# Altium project BSPD.PrjPcb
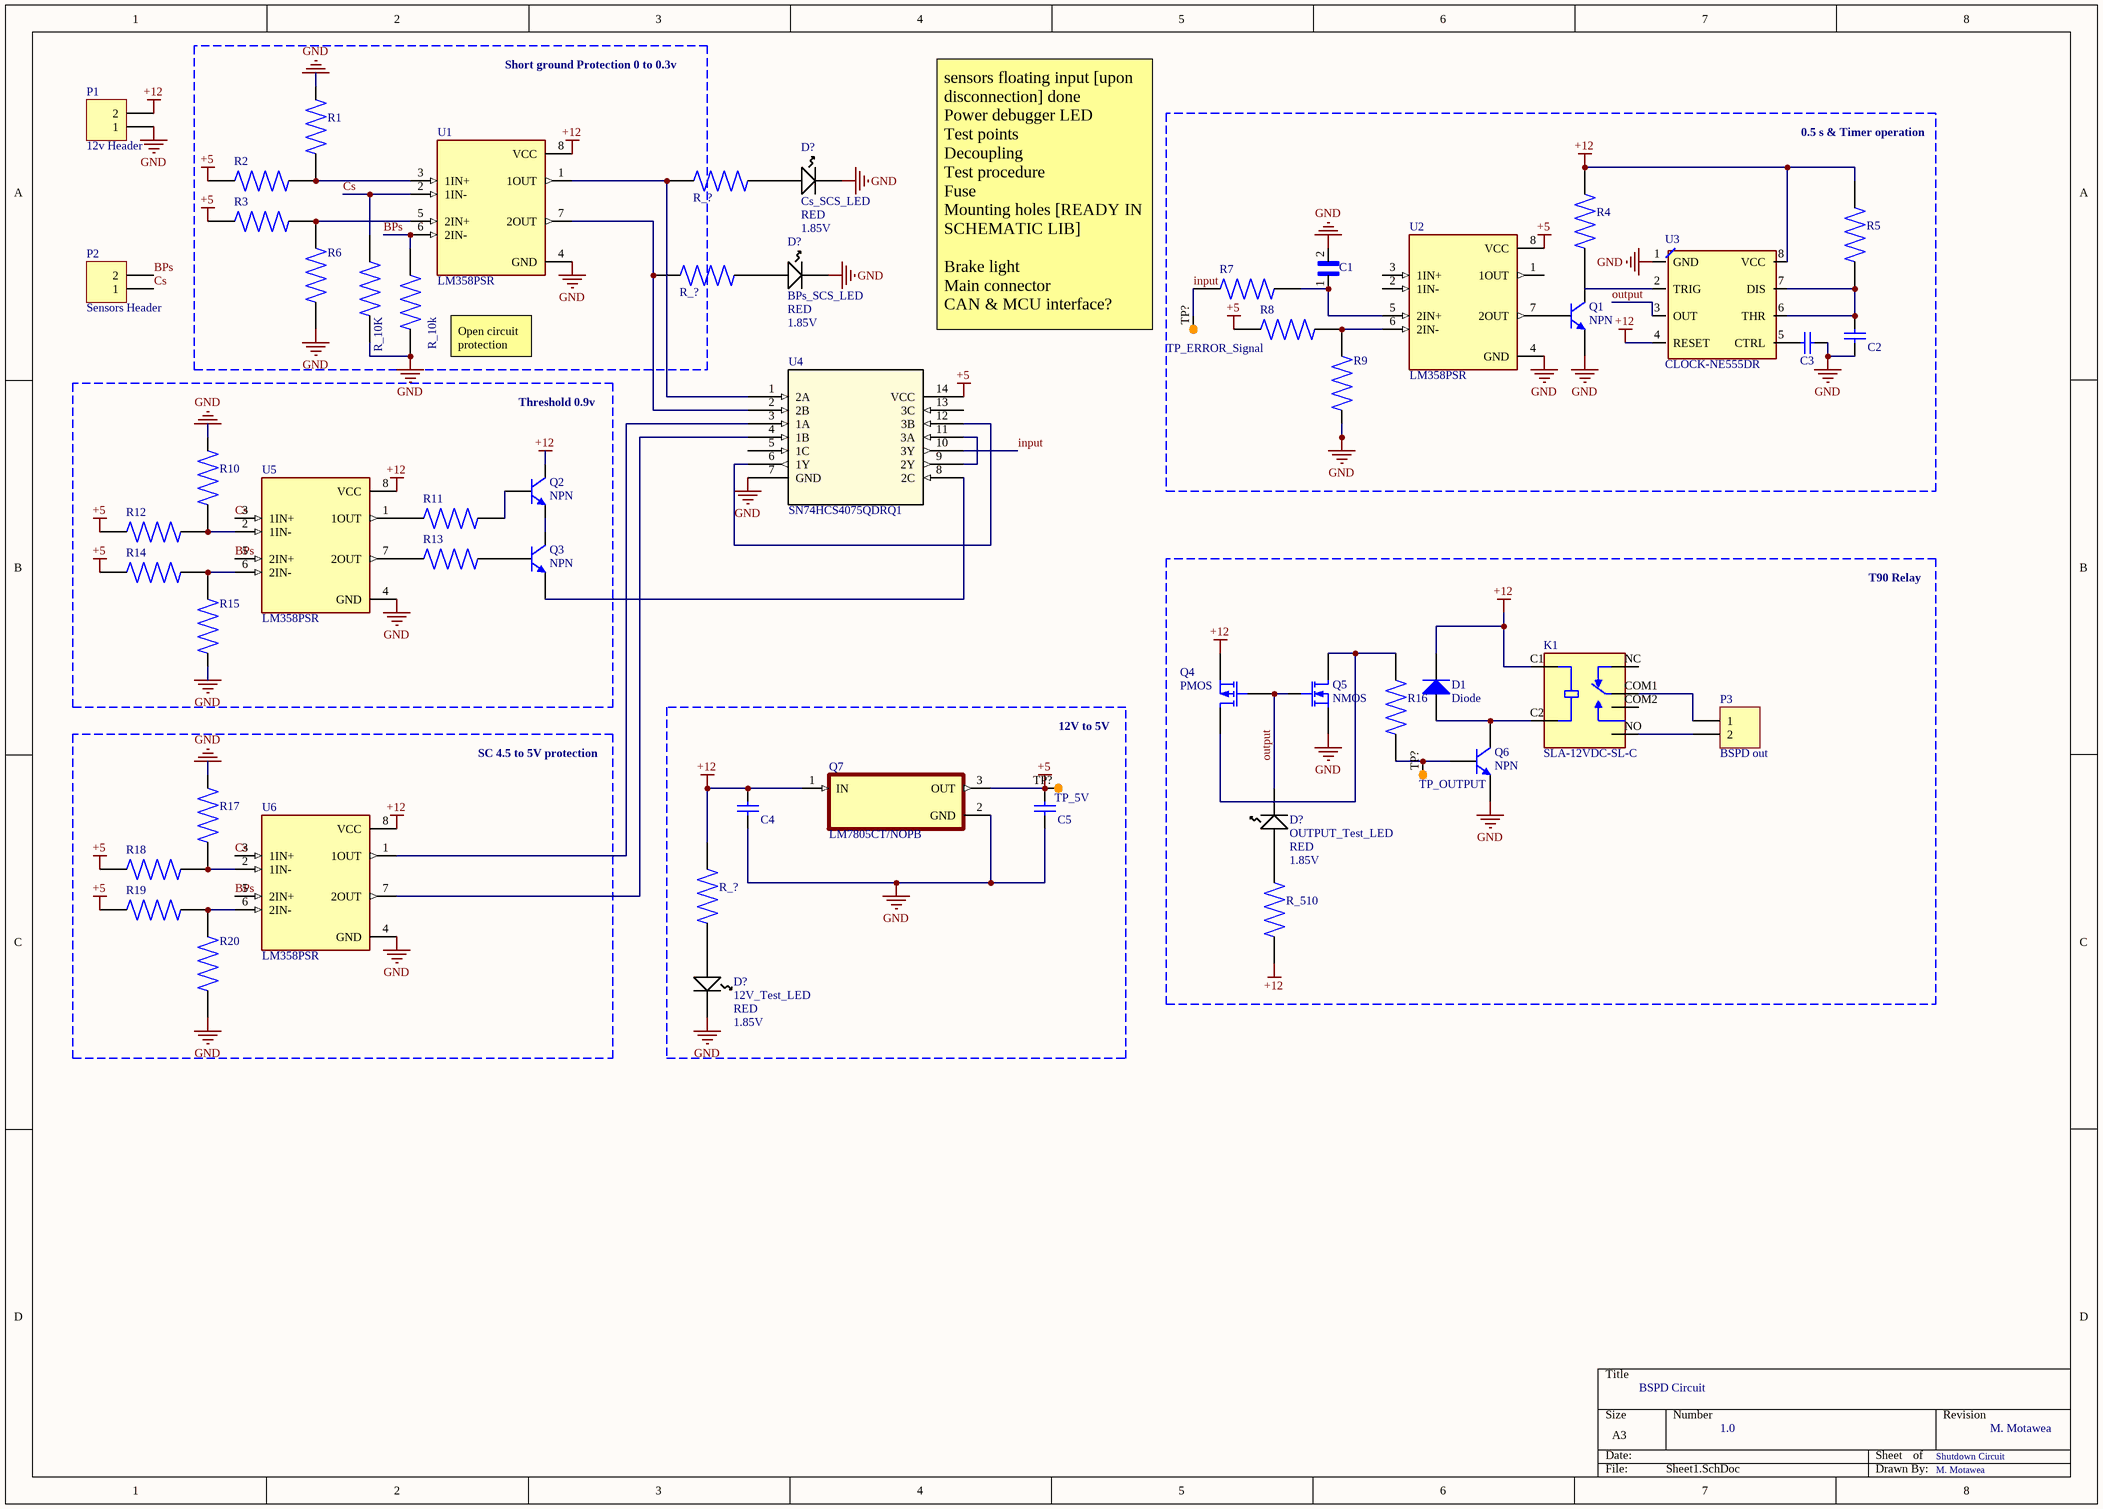
[diagram p0: Sheet1.SchDoc]
Author: M. Motawea; Project: BSPD Circuit
1 sheet, 56 parts. Net scope: global (net labels, ports and power ports of the same name join across sheets).
Board file: PCB1.PcbDoc

## Sheet Sheet1.SchDoc
size A3; SheetNumber: 1; SheetTotal: 1; SPICEModelCacheMZGQAUMV: <root> / <DocumentId>MZGQAUMV</DocumentId> / <CacheFrame Number="0"> / <Model Name="npn" Kind="MDL"> / <Text>*Default NPN BJT / *NPN Trans Pinout: C,B,E / .MODEL NPN NPN()</Text> / </Model> / <Model Name="1812_885012210019_10nf" Kind="CKT"> / <Text>******* / .subckt 1812_885012210019_10nF 1 2 / Rser 1 3 0.07293 / Lser 2 4 0.00000000052871 / C1 3 4 0.00000001 / Rpar 3 4 10000000000 / .ends 1812_885012210019_10nF</Text> / </Model> / <Model Name="2220_885012214006_10uf" Kind="CKT"> / <Text>******* / .subckt 2220_885012214006_10uF 1 2 / Rser 1 3 0.003 / Lser 2 4 0.0000000012 / C1 3 4 0.00001 / Rpar 3 4 10000000 / .ends 2220_885012214006_10uF</Text> / </Model> / <Model Name="diode" Kind="MDL"> / <Text>*Default Diode / *Diode Pinout: A,K / .MODEL DIODE D()</Text> / </Model> / <Model Name="nmos" Kind="MDL"> / <Text>*Default N-Channel MOSFET / *Pinout: D,G,S / .MODEL NMOS NMOS()</Text> / </Model> / <Model Name="pmos" Kind="MDL"> / <Text>*Default P-Channel MOSFET / *Pinout: D,G,S / .MODEL PMOS PMOS()</Text> / </Model> / <Model Name="1210_885012209020_220nf" Kind="CKT"> / <Text>******* / .subckt 1210_885012209020_220nF 1 2 / Rser 1 3 0.0109918196754 / Lser 2 4 5.14177759E-10 / C1 3 4 0.00000022 / Rpar 3 4 2300000000 / .ends 1210_885012209020_220nF</Text> / </Model> / <Model Name="1210_885012209019_100nf" Kind="CKT"> / <Text>******* / .subckt 1210_885012209019_100nF 1 2 / Rser 1 3 0.0209574310072 / Lser 2 4 5.49171232E-10 / C1 3 4 0.0000001 / Rpar 3 4 5000000000 / .ends 1210_885012209019_100nF</Text> / </Model> / </CacheFrame> / </root>

### Parts
(Parts that share a designator on the sheet are numbered #1, #2 ... from top to bottom, then left to right.)
C1  GRM21BR60J107ME15K  [CAPC2012X145N]  (value not drawn)
C2  10uF  [WCAP-CSGP_2220_L5.7W5H2.8]  (value not drawn)
C3  10nF  [WCAP-CSGP_1812_L4.5W3.2H1.25]  (value not drawn)
C4  220nF  [WCAP-CSGP_1210_L3.2W2.5H0.95]  (value not drawn)
C5  100nF  [WCAP-CSGP_1210_L3.2W2.5H0.95]  (value not drawn)
D1  Diode  [SMC]
D?#1  Cs_SCS_LED  Color: RED  Forward Voltage: 1.85V  [LED1913X12NRED]
D?#2  BPs_SCS_LED  Color: RED  Forward Voltage: 1.85V  [LED1913X12NRED]
D?#3  OUTPUT_Test_LED  Color: RED  Forward Voltage: 1.85V  [LED1913X12NRED]
D?#4  12V_Test_LED  Color: RED  Forward Voltage: 1.85V  [LED1913X12NRED]
K1  SLA-12VDC-SL-C  [RELAY_SLA-12VDC-SL-C]
P1  12v Header  [HDR1X2]
P2  Sensors Header  [HDR1X2]
P3  BSPD out  [HDR1X2]
Q1  NPN  [TO-226-AA]
Q2  NPN  [TO-226-AA]
Q3  NPN  [TO-226-AA]
Q4  PMOS  [E3]
Q5  NMOS  [E3]
Q6  NPN  [TO-226-AA]
Q7  LM7805CT/NOPB  [TO254P1054X470X1955-3]
R1  ERJU08J274V  [RES_ERJU08J274V]  (value not drawn)
R2  ERJU08J274V  [RES_ERJU08J274V]  (value not drawn)
R3  ERJU08J274V  [RES_ERJU08J274V]  (value not drawn)
R4  ERJU08J274V  [RES_ERJU08J274V]  (value not drawn)
R5  ERJU08J274V  [RES_ERJU08J274V]  (value not drawn)
R6  ERJU08J274V  [RES_ERJU08J274V]  (value not drawn)
R7  ERJU08J274V  [RES_ERJU08J274V]  (value not drawn)
R8  ERJU08J274V  [RES_ERJU08J274V]  (value not drawn)
R9  ERJU08J274V  [RES_ERJU08J274V]  (value not drawn)
R10  ERJU08J274V  [RES_ERJU08J274V]  (value not drawn)
R11  ERJU08J274V  [RES_ERJU08J274V]  (value not drawn)
R12  ERJU08J274V  [RES_ERJU08J274V]  (value not drawn)
R13  ERJU08J274V  [RES_ERJU08J274V]  (value not drawn)
R14  ERJU08J274V  [RES_ERJU08J274V]  (value not drawn)
R15  ERJU08J274V  [RES_ERJU08J274V]  (value not drawn)
R16  ERJU08J274V  [RES_ERJU08J274V]  (value not drawn)
R17  ERJU08J274V  [RES_ERJU08J274V]  (value not drawn)
R18  ERJU08J274V  [RES_ERJU08J274V]  (value not drawn)
R19  ERJU08J274V  [RES_ERJU08J274V]  (value not drawn)
R20  ERJU08J274V  [RES_ERJU08J274V]  (value not drawn)
R_10K#1  ERJU08J274V  [RES_ERJU08J274V]  (value not drawn)
R_10k#2  ERJU08J274V  [RES_ERJU08J274V]  (value not drawn)
R_510  ERJU08J274V  [RES_ERJU08J274V]  (value not drawn)
R_?#1  ERJU08J274V  [RES_ERJU08J274V]  (value not drawn)
R_?#2  ERJU08J274V  [RES_ERJU08J274V]  (value not drawn)
R_?#3  ERJU08J274V  [RES_ERJU08J274V]  (value not drawn)
TP_5V  TP  [Test point]  (value not drawn)
TP_ERROR_Signal  TP  [Test point]  (value not drawn)
TP_OUTPUT  TP  [Test point]  (value not drawn)
U1  LM358PSR  [SOIC127P780X200-8N]
U2  LM358PSR  [SOIC127P780X200-8N]
U3  CLOCK-NE555DR  [SOIC8-1.27-5X4MM]
U4  SN74HCS4075QDRQ1  [SOIC14_D_TEX]
U5  LM358PSR  [SOIC127P780X200-8N]
U6  LM358PSR  [SOIC127P780X200-8N]

### Blocks framed on the sheet
Short ground Protection 0 to 0.3v: R1-R3 R6 R_10K#1 R_10k#2 U1
0.5 s & Timer operation: C1-C3 Q1 R4 R5 R7-R9 TP_ERROR_Signal U2 U3
Threshold 0.9v: Q2 Q3 R10-R15 U5
T90 Relay: D1 D?#3 K1 P3 Q4-Q6 R16 R_510 TP_OUTPUT
12V to 5V: C4 C5 D?#4 Q7 R_?#3 TP_5V
SC 4.5 to 5V protection: R17-R20 U6

### Nets
+5: C5.2 Q7.3(OUT) R2.1 R3.1 R8.1 R12.1 R14.1 R18.1 R19.1 TP_5V.TP?(Test_point) U2.8(VCC) U4.14(VCC)
+12: C4.2 D1.2(K) K1.C1(COIL1) P1.2 Q2.1(C) Q4.3(S) Q7.1(IN) R4.2 R5.2 R_510.1 R_?#3.1 U1.8(VCC) U3.4(RESET) U3.8(VCC) U5.8(VCC) U6.8(VCC)
GND: C1.2 C2.1 C3.2 C4.1 C5.1 D?#1.2(K) D?#2.2(K) D?#4.2(K) P1.1 Q1.3(E) Q5.3(S) Q6.3(E) Q7.2(GND) R1.2 R6.2 R9.2 R10.2 R15.2 R17.2 R20.2 R_10K#1.2 R_10k#2.2 U1.4(GND) U2.4(GND) U3.1(GND) U4.7(GND) U5.4(GND) U6.4(GND)
BPs: P2.2 R_10k#2.1 U1.6(2IN-) U5.5(2IN+) U6.5(2IN+)
Cs: P2.1 R_10K#1.1 U1.2(1IN-) U5.3(1IN+) U6.3(1IN+)
input: R7.1 TP_ERROR_Signal.TP?(Test_point) U4.10(3Y)
output: D?#3.2(K) Q4.2(G) Q5.2(G) U3.3(OUT)
NetC1_1: C1.1 R7.2 U2.5(2IN+)
NetC2_2: C2.2 R5.1 U3.6(THR) U3.7(DIS)
NetC3_1: C3.1 U3.5(CTRL)
NetD1_1: D1.1(A) K1.C2(COIL2) Q6.1(C)
NetD?#1_1: D?#1.1(A) R_?#1.2
NetD?#2_1: D?#2.1(A) R_?#2.2
NetD?#3_1: D?#3.1(A) R_510.2
NetD?#4_1: D?#4.1(A) R_?#3.2
NetK1_COM1: K1.COM1(COM) P3.1
NetK1_NO: K1.NO P3.2
NetQ1_1: Q1.1(C) R4.1
NetQ1_2: Q1.2(B) U2.7(2OUT)
NetQ2_2: Q2.2(B) R11.2
NetQ2_3: Q2.3(E) Q3.1(C)
NetQ3_2: Q3.2(B) R13.2
NetQ3_3: Q3.3(E) U4.8(2C)
NetQ4_1: Q4.1(D) Q5.1(D) R16.2
NetQ6_2: Q6.2(B) R16.1 TP_OUTPUT.TP?(Test_point)
NetR1_1: R1.1 R2.2 U1.3(1IN+)
NetR3_2: R3.2 R6.1 U1.5(2IN+)
NetR8_2: R8.2 R9.1 U2.6(2IN-)
NetR10_1: R10.1 R12.2 U5.2(1IN-)
NetR11_1: R11.1 U5.1(1OUT)
NetR13_1: R13.1 U5.7(2OUT)
NetR14_2: R14.2 R15.1 U5.6(2IN-)
NetR17_1: R17.1 R18.2 U6.2(1IN-)
NetR19_2: R19.2 R20.1 U6.6(2IN-)
NetR_?#1_1: R_?#1.1 U1.1(1OUT) U4.1(2A)
NetR_?#2_1: R_?#2.1 U1.7(2OUT) U4.2(2B)
NetU4_3: U4.3(1A) U6.1(1OUT)
NetU4_4: U4.4(1B) U6.7(2OUT)
NetU4_6: U4.6(1Y) U4.12(3B)
NetU4_9: U4.9(2Y) U4.11(3A)

Not connected (* = marked no-connect by the designer): K1 COM2(COM) NC; U2 1(1OUT) 2(1IN-) 3(1IN+); U3 2(TRIG); U4 5(1C) 13(3C)

### Notes on the sheet
- Open circuit protection
- (near TP_ERROR_Signal) sensors floating input [upon disconnection] done
  Power debugger LED
  Test points
  Decoupling
  Test procedure
  Fuse
  Mounting holes [READY IN SCHEMATIC LIB]
  Brake light
  Main connector
  CAN & MCU interface?
- 1.0
- Shutdown Circuit

### Library data of the parts
C1 = GRM21BR60J107ME15K: 0805 100 uF 6.3 V Â±20% Tolerance X7S Multilayer Ceramic Chip Capacitor; MF: Murata Electronics; Availability: In Stock; Price: None; SnapEDA_Link: https://www.snapeda.com/parts/GRM21BR60J107ME15K/Murata%20Electronics%20North%20America/view-part/1845859/?ref=snap; Value: *; Check_prices: https://www.snapeda.com/parts/GRM21BR60J107ME15K/Murata%20Electronics%20North%20America/view-part/1845859/?ref=eda; MP: GRM21BR60J107ME15K; Package: 2012 Murata
C2 = 885012214006: WCAP-CSGP Multilayer Ceramic Chip Capacitor, General Purpose, size 2220, X7R Class II, 10uF, 100VDC; Manufacturer: Wurth Elektronik; Case/Size Code: 2220; Capacitance Tolerance: +/-10%; Dissipation Factor: 2.5%; Insulation Resistance: 0.01GOhm; Rated Voltage (DC): 100V; Technical Reference: X7R2220106K100DFCT10000; Manufacturer Part Number: 885012214006; Category: Multilayer Ceramic Chip Capacitors; Match Code: WCAP-CSGP; ComponentLink1Description: Website Link; ComponentLink1URL: https://www.we-online.com/redexpert/article/885012214006?ad; ComponentLink2Description: Datasheet Link; ComponentLink2URL: https://www.we-online.com/redexpert/spec/885012214006?ad; Mount: Surface Mount; Operating Temperature Max: 125°C; Operating Temperature Min: -55°C; Packaging: Tape and Reel; Length: 5.7mm; Width: 5mm; Height: 2.8mm; Capacitance: 10uF; Ceramic Type: X7R Class II
C3 = 885012210019: WCAP-CSGP Multilayer Ceramic Chip Capacitor, General Purpose, size 1812, X7R, 10nF, 50VDC; Manufacturer: Wurth Elektronik; Case/Size Code: 1812; Capacitance Tolerance: +/-10%; Dissipation Factor: 2.5%; Insulation Resistance: 10GOhm; Rated Voltage (DC): 50V; Technical Reference: X7R1812103K050DFCT10000; Manufacturer Part Number: 885012210019; Category: Multilayer Ceramic Chip Capacitors; Match Code: WCAP-CSGP; ComponentLink1Description: Website Link; ComponentLink1URL: https://www.we-online.com/redexpert/article/885012210019?ad; ComponentLink2Description: Datasheet Link; ComponentLink2URL: https://www.we-online.com/redexpert/spec/885012210019?ad; Mount: Surface Mount; Operating Temperature Max: 125°C; Operating Temperature Min: -55°C; Packaging: Tape and Reel; Length: 4.5mm; Width: 3.2mm; Height: 1.25mm; Capacitance: 10nF; Ceramic Type: X7R
C4 = 885012209020: WCAP-CSGP Multilayer Ceramic Chip Capacitor, General Purpose, size 1210, X7R, 220nF, 25VDC; Manufacturer: Wurth Elektronik; Case/Size Code: 1210; Capacitance Tolerance: +/-10%; Dissipation Factor: 3.5%; Insulation Resistance: 2.3GOhm; Rated Voltage (DC): 25V; Technical Reference: X7R1210224K025DFCT10000; Manufacturer Part Number: 885012209020; Category: Multilayer Ceramic Chip Capacitors; Match Code: WCAP-CSGP; ComponentLink1Description: Website Link; ComponentLink1URL: https://www.we-online.com/redexpert/article/885012209020?ad; ComponentLink2Description: Datasheet Link; ComponentLink2URL: https://www.we-online.com/redexpert/spec/885012209020?ad; Mount: Surface Mount; Operating Temperature Max: 125°C; Operating Temperature Min: -55°C; Packaging: Tape and Reel; Length: 3.2mm; Width: 2.5mm; Height: 0.95mm; Capacitance: 220nF; Ceramic Type: X7R
C5 = 885012209019: WCAP-CSGP Multilayer Ceramic Chip Capacitor, General Purpose, size 1210, X7R, 100nF, 25VDC; Manufacturer: Wurth Elektronik; Case/Size Code: 1210; Capacitance Tolerance: +/-10%; Dissipation Factor: 3.5%; Insulation Resistance: 5GOhm; Rated Voltage (DC): 25V; Technical Reference: X7R1210104K025DFCT10000; Manufacturer Part Number: 885012209019; Category: Multilayer Ceramic Chip Capacitors; Match Code: WCAP-CSGP; ComponentLink1Description: Website Link; ComponentLink1URL: https://www.we-online.com/redexpert/article/885012209019?ad; ComponentLink2Description: Datasheet Link; ComponentLink2URL: https://www.we-online.com/redexpert/spec/885012209019?ad; Mount: Surface Mount; Operating Temperature Max: 125°C; Operating Temperature Min: -55°C; Packaging: Tape and Reel; Length: 3.2mm; Width: 2.5mm; Height: 0.95mm; Capacitance: 100nF; Ceramic Type: X7R
D1 = Diode: Default Diode; Published: 8-Jun-2000; LatestRevisionDate: 17-Jul-2002; LatestRevisionNote: Re-released for DXP Platform.; PackageVersion: Sep-1996; PackageReference: SMC; Publisher: Altium Limited; PackageDescription: DO-214-AB/SMC; 2 C-Bend Leads; Body 7.9 x 5.9 mm, inc. leads (LxW); Code_JEDEC: DO-214-AB
D?#1-D?#4 = Kingbright Red LED, 100 mcd 120 ° 0805: Manufacturer Part No.: KP-2012SRC-PRV; Creator: Ritesh Kanjee; Date Created: 18 February 2015; Manufacturer: KingBright; RS Stock No.: 466-3813; Datasheet URL: http://za.rs-online.com/web/p/visible-leds/4663813/
K1 = SLA-12VDC-SL-C: SUBMINATURE HIGH POWER RELAY; MF: Songle Relay; Value: *; SnapEDA_Link: https://www.snapeda.com/parts/SLA-12VDC-SL-C/Songle+Relay/view-part/?ref=snap; MP: SLA-12VDC-SL-C; Check_prices: https://www.snapeda.com/parts/SLA-12VDC-SL-C/Songle+Relay/view-part/?ref=eda; Availability: Not in stock; Price: None; Package: None
P1-P3 = Header 2: Header, 2-Pin; LatestRevisionDate: 17-Jul-2002; LatestRevisionNote: Re-released for DXP Platform.; Publisher: Altium Limited
Q1-Q3 Q6 = NPN: NPN Bipolar Transistor; Published: 8-Jun-2000; LatestRevisionDate: 17-Jul-2002; LatestRevisionNote: Re-released for DXP Platform.; PackageReference: TO-226-AA; Publisher: Altium Limited; PackageDescription: TO, Flat Index; 3 In-Line, Axial Leads; Body Dia. 4.8mm; Leads 0.55 x 0.51 mm (max); Code_JEDEC: TO-226-AA
Q4 = MOSFET-P: P-Channel MOSFET; Published: 8-Jun-2000; LatestRevisionDate: 17-Jul-2002; LatestRevisionNote: Re-released for DXP Platform.; PackageVersion: 1995/1996; PackageReference: E3; Publisher: Altium Limited; PackageDescription: TO, Flat Index; 3 In-Line, Axial Leads; Body Dia. 4.6mm; Lead Dia. 0.5 mm (max)
Q5 = MOSFET-N: N-Channel MOSFET; Published: 8-Jun-2000; LatestRevisionDate: 17-Jul-2002; LatestRevisionNote: Re-released for DXP Platform.; PackageVersion: 1995/1996; PackageReference: E3; Publisher: Altium Limited; PackageDescription: TO, Flat Index; 3 In-Line, Axial Leads; Body Dia. 4.6mm; Lead Dia. 0.5 mm (max)
R1-R20 R_10K#1 R_10k#2 R_510 R_?#1-R_?#3 = ERJU08J274V: 1206 anti-sulfurated resistor 1206 Anti-Sulfurated; MF: Panasonic; MP: ERJ-U08J274V; SnapEDA_Link: https://www.snapeda.com/parts/ERJ-U08J274V/Panasonic/view-part/?ref=snap; Package: 3216-2 Panasonic; Value: *; Check_prices: https://www.snapeda.com/parts/ERJ-U08J274V/Panasonic/view-part/?ref=eda
TP_5V TP_ERROR_Signal TP_OUTPUT = Test point: Value: TP
U1 U2 U5 U6 = LM358PSR: General Purpose Amplifier 2 Circuit 8-SO; MF: Texas Instruments; Package: SO-8 Texas Instruments; Value: *; Price: None; MP: LM358PSR; SnapEDA_Link: https://www.snapeda.com/parts/LM358PSR/Texas%20Instruments/view-part/501080/?ref=snap; Availability: Unavailable
U3 = CLOCK-NE555DR(SOIC8): Single Precision Timer; MF: Texas Instruments; SnapEDA_Link: https://www.snapeda.com/parts/NE555DR/Texas+Instruments/view-part/?ref=snap; Package: SOIC-8 Texas Instruments; Value: *; MP: NE555DR; Check_prices: https://www.snapeda.com/parts/NE555DR/Texas+Instruments/view-part/?ref=eda
U4 = SN74HCS4075QDRQ1: No Description Available; Mfr_Name: Texas Instruments; Type: Logic; RefDes: RefDes
Q7 = LM7805CT/NOPB: Price: None; MP: LM7805CT/NOPB; Availability: Unavailable; Value: *; Package: None